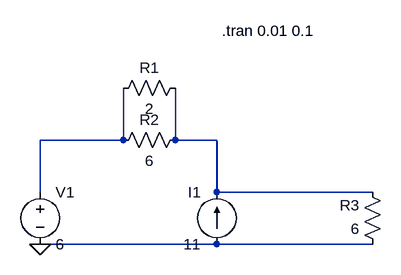
[diagram p0: schematic Draft28.asc]
Draft28.asc, the LTspice schematic file:
Version 4
SHEET 1 880 680
WIRE 336 256 336 176
WIRE 336 256 208 256
WIRE 416 256 416 176
WIRE 480 256 416 256
WIRE 208 336 208 256
WIRE 480 336 480 256
WIRE 720 336 480 336
WIRE 480 416 208 416
WIRE 720 416 480 416
FLAG 208 416 0
SYMBOL voltage 208 320 R0
SYMATTR InstName V1
SYMATTR Value 6
SYMBOL current 480 416 R180
WINDOW 0 24 80 Left 2
WINDOW 3 24 0 Left 2
SYMATTR InstName I1
SYMATTR Value 11
SYMBOL res 432 160 R90
WINDOW 0 0 56 VBottom 2
WINDOW 3 32 56 VTop 2
SYMATTR InstName R1
SYMATTR Value 2
SYMBOL res 432 240 R90
WINDOW 0 0 56 VBottom 2
WINDOW 3 32 56 VTop 2
SYMATTR InstName R2
SYMATTR Value 6
SYMBOL res 736 432 R180
WINDOW 0 36 76 Left 2
WINDOW 3 36 40 Left 2
SYMATTR InstName R3
SYMATTR Value 6
TEXT 488 88 Left 2 !.tran 0.01 0.1

The netlist it stands for:
* Draft28.asc
V1 N001 0 6
I1 0 N002 11
R1 N002 N001 2
R2 N002 N001 6
R3 0 N002 6
.tran 0.01 0.1
.backanno
.end